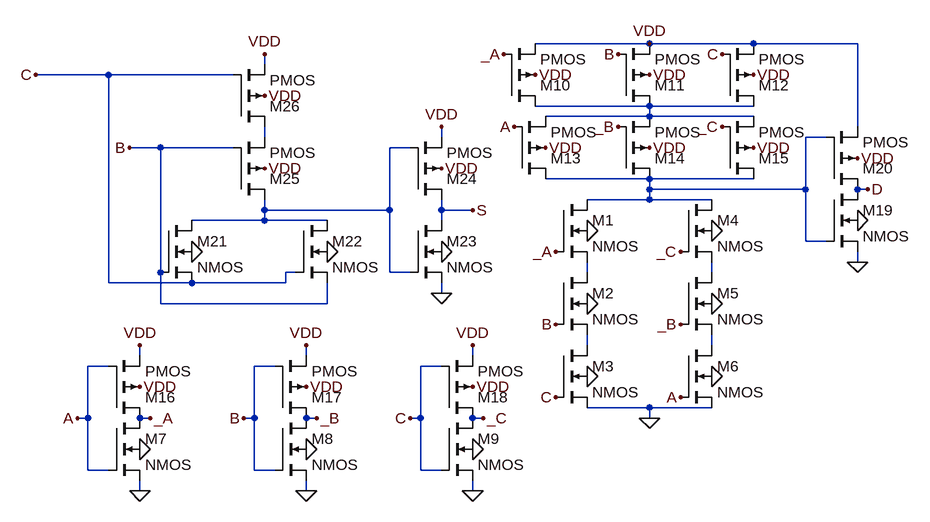
[diagram p0: schematic Encoder-v3.asc]
Encoder-v3.asc, the LTspice schematic file:
Version 4
SHEET 1 880 680
WIRE -384 -992 -560 -992
WIRE -224 -992 -384 -992
WIRE -64 -992 -224 -992
WIRE -976 -960 -976 -976
WIRE -1216 -944 -1328 -944
WIRE -1024 -944 -1216 -944
WIRE -384 -896 -560 -896
WIRE -224 -896 -384 -896
WIRE -384 -880 -384 -896
WIRE -384 -880 -544 -880
WIRE -224 -880 -384 -880
WIRE -64 -864 -64 -992
WIRE -976 -848 -976 -864
WIRE -704 -848 -704 -864
WIRE -112 -848 -144 -848
WIRE -1136 -832 -1184 -832
WIRE -1024 -832 -1136 -832
WIRE -752 -832 -784 -832
WIRE -384 -784 -544 -784
WIRE -224 -784 -384 -784
WIRE -384 -768 -384 -784
WIRE -144 -768 -144 -848
WIRE -144 -768 -384 -768
WIRE -64 -768 -64 -784
WIRE -48 -768 -64 -768
WIRE -384 -752 -384 -768
WIRE -384 -752 -480 -752
WIRE -288 -752 -384 -752
WIRE -976 -736 -976 -752
WIRE -784 -736 -784 -832
WIRE -784 -736 -976 -736
WIRE -704 -736 -704 -752
WIRE -656 -736 -704 -736
WIRE -976 -720 -976 -736
WIRE -976 -720 -1088 -720
WIRE -880 -720 -976 -720
WIRE -704 -720 -704 -736
WIRE -144 -688 -144 -768
WIRE -112 -688 -144 -688
WIRE -64 -656 -64 -672
WIRE -1136 -640 -1136 -832
WIRE -928 -640 -944 -640
WIRE -784 -640 -784 -736
WIRE -752 -640 -784 -640
WIRE -480 -640 -480 -656
WIRE -288 -640 -288 -656
WIRE -1216 -624 -1216 -944
WIRE -1088 -624 -1216 -624
WIRE -944 -624 -944 -640
WIRE -944 -624 -1088 -624
WIRE -704 -608 -704 -624
WIRE -1136 -592 -1136 -640
WIRE -880 -592 -880 -624
WIRE -880 -592 -1136 -592
WIRE -480 -528 -480 -544
WIRE -288 -528 -288 -544
WIRE -1168 -512 -1168 -528
WIRE -912 -512 -912 -528
WIRE -656 -512 -656 -528
WIRE -1216 -496 -1248 -496
WIRE -960 -496 -992 -496
WIRE -704 -496 -736 -496
WIRE -384 -432 -480 -432
WIRE -288 -432 -384 -432
WIRE -1248 -416 -1248 -496
WIRE -1248 -416 -1264 -416
WIRE -1168 -416 -1168 -432
WIRE -1152 -416 -1168 -416
WIRE -992 -416 -992 -496
WIRE -992 -416 -1008 -416
WIRE -912 -416 -912 -432
WIRE -896 -416 -912 -416
WIRE -736 -416 -736 -496
WIRE -736 -416 -752 -416
WIRE -656 -416 -656 -432
WIRE -640 -416 -656 -416
WIRE -384 -416 -384 -432
WIRE -1248 -336 -1248 -416
WIRE -1216 -336 -1248 -336
WIRE -992 -336 -992 -416
WIRE -960 -336 -992 -336
WIRE -736 -336 -736 -416
WIRE -704 -336 -736 -336
WIRE -1168 -304 -1168 -320
WIRE -912 -304 -912 -320
WIRE -656 -304 -656 -320
FLAG -288 -480 0
FLAG -288 -592 0
FLAG -288 -704 0
FLAG -480 -704 0
FLAG -480 -592 0
FLAG -1168 -368 0
FLAG -1168 -304 0
FLAG -912 -304 0
FLAG -656 -304 0
FLAG -656 -368 0
FLAG -912 -368 0
FLAG -480 -480 0
FLAG -560 -944 VDD
FLAG -384 -944 VDD
FLAG -224 -944 VDD
FLAG -544 -832 VDD
FLAG -384 -832 VDD
FLAG -224 -832 VDD
FLAG -656 -464 VDD
FLAG -912 -464 VDD
FLAG -1168 -464 VDD
FLAG -384 -992 VDD
FLAG -656 -528 VDD
FLAG -912 -528 VDD
FLAG -1168 -528 VDD
FLAG -1264 -416 A
FLAG -1152 -416 _A
FLAG -1008 -416 B
FLAG -896 -416 _B
FLAG -752 -416 C
FLAG -640 -416 _C
FLAG -608 -976 _A
FLAG -528 -672 _A
FLAG -432 -976 B
FLAG -528 -560 B
FLAG -528 -448 C
FLAG -272 -976 C
FLAG -592 -864 A
FLAG -336 -448 A
FLAG -432 -864 _B
FLAG -336 -560 _B
FLAG -336 -672 _C
FLAG -272 -864 _C
FLAG -64 -656 0
FLAG -64 -720 0
FLAG -64 -816 VDD
FLAG -48 -768 D
FLAG -384 -416 0
FLAG -1088 -672 0
FLAG -880 -672 0
FLAG -976 -800 VDD
FLAG -976 -912 VDD
FLAG -976 -976 VDD
FLAG -704 -672 0
FLAG -704 -608 0
FLAG -704 -800 VDD
FLAG -704 -864 VDD
FLAG -1184 -832 B
FLAG -1328 -944 C
FLAG -656 -736 S
SYMBOL nmos4 -528 -752 R0
SYMATTR InstName M1
SYMBOL nmos4 -528 -640 R0
SYMATTR InstName M2
SYMBOL nmos4 -528 -528 R0
SYMATTR InstName M3
SYMBOL nmos4 -336 -752 R0
SYMATTR InstName M4
SYMBOL nmos4 -336 -640 R0
SYMATTR InstName M5
SYMBOL nmos4 -336 -528 R0
SYMATTR InstName M6
SYMBOL nmos4 -1216 -416 R0
SYMATTR InstName M7
SYMBOL nmos4 -960 -416 R0
SYMATTR InstName M8
SYMBOL nmos4 -704 -416 R0
SYMATTR InstName M9
SYMBOL pmos4 -608 -896 M180
SYMATTR InstName M10
SYMBOL pmos4 -432 -896 M180
SYMATTR InstName M11
SYMBOL pmos4 -272 -896 M180
SYMATTR InstName M12
SYMBOL pmos4 -592 -784 M180
SYMATTR InstName M13
SYMBOL pmos4 -432 -784 M180
SYMATTR InstName M14
SYMBOL pmos4 -272 -784 M180
SYMATTR InstName M15
SYMBOL pmos4 -1216 -416 M180
SYMATTR InstName M16
SYMBOL pmos4 -960 -416 M180
SYMATTR InstName M17
SYMBOL pmos4 -704 -416 M180
SYMATTR InstName M18
SYMBOL nmos4 -112 -768 R0
SYMATTR InstName M19
SYMBOL pmos4 -112 -768 M180
SYMATTR InstName M20
SYMBOL nmos4 -1136 -720 R0
SYMATTR InstName M21
SYMBOL nmos4 -928 -720 R0
SYMATTR InstName M22
SYMBOL nmos4 -752 -720 R0
SYMATTR InstName M23
SYMBOL pmos4 -752 -752 M180
SYMATTR InstName M24
SYMBOL pmos4 -1024 -752 M180
SYMATTR InstName M25
SYMBOL pmos4 -1024 -864 M180
SYMATTR InstName M26

The netlist it stands for:
* Encoder-v3.asc
M1 N003 _A N005 0 NMOS
M2 N005 B N007 0 NMOS
M3 N007 C 0 0 NMOS
M4 N003 _C N006 0 NMOS
M5 N006 _B N008 0 NMOS
M6 N008 A 0 0 NMOS
M7 _A A 0 0 NMOS
M8 _B B 0 0 NMOS
M9 _C C 0 0 NMOS
M10 N001 _A VDD VDD PMOS
M11 N001 B VDD VDD PMOS
M12 N001 C VDD VDD PMOS
M13 N003 A N001 VDD PMOS
M14 N003 _B N001 VDD PMOS
M15 N003 _C N001 VDD PMOS
M16 _A A VDD VDD PMOS
M17 _B B VDD VDD PMOS
M18 _C C VDD VDD PMOS
M19 D N003 0 0 NMOS
M20 D N003 VDD VDD PMOS
M21 N004 B C 0 NMOS
M22 N004 C B 0 NMOS
M23 S N004 0 0 NMOS
M24 S N004 VDD VDD PMOS
M25 N004 B N002 VDD PMOS
M26 N002 C VDD VDD PMOS
.model NMOS NMOS
.model PMOS PMOS
.lib standard.mos
.backanno
.end